# Altium project PCB_Project.PrjPcb
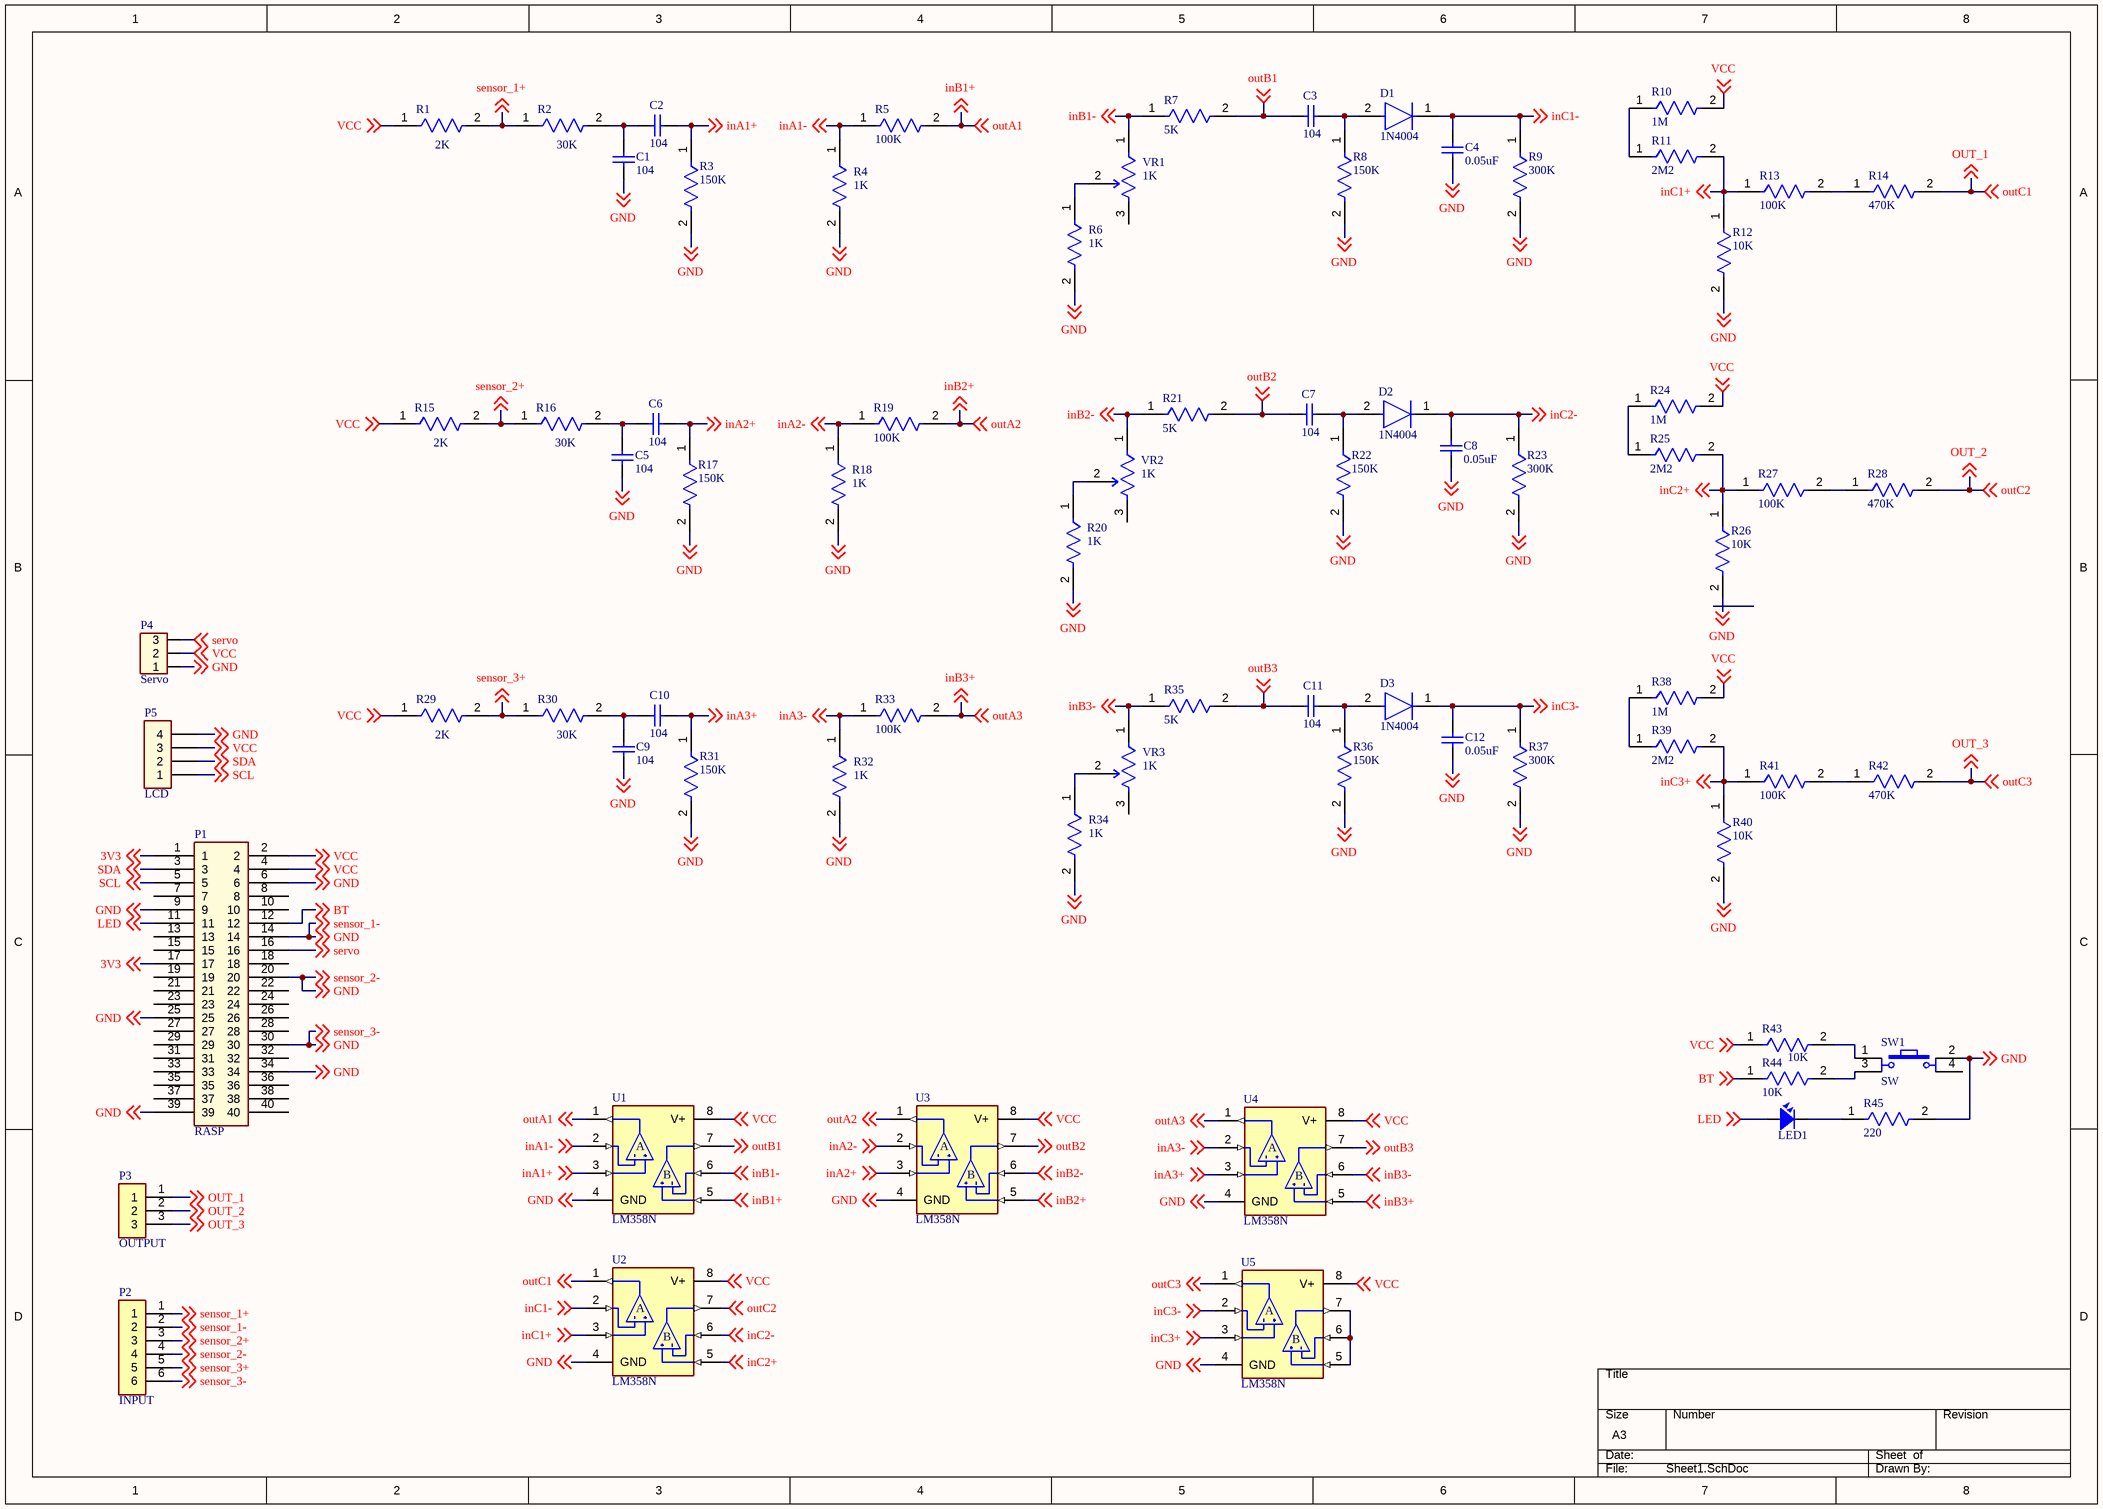
[diagram p0: Sheet1.SchDoc]
1 sheet, 75 parts. Net scope: global (net labels, ports and power ports of the same name join across sheets).
Board file: PCB1.PcbDoc

## Sheet Sheet1.SchDoc
size A3; SheetNumber: 1; SheetTotal: 1

### Parts
C1  104  [CAP_CERAMIC_MULTI]
C2  104  [CAP_CERAMIC_MULTI]
C3  104  [CAP_CERAMIC_MULTI]
C4  0.05uF  [CAP_CERAMIC_MULTI]
C5  104  [CAP_CERAMIC_MULTI]
C6  104  [CAP_CERAMIC_MULTI]
C7  104  [CAP_CERAMIC_MULTI]
C8  0.05uF  [CAP_CERAMIC_MULTI]
C9  104  [CAP_CERAMIC_MULTI]
C10  104  [CAP_CERAMIC_MULTI]
C11  104  [CAP_CERAMIC_MULTI]
C12  0.05uF  [CAP_CERAMIC_MULTI]
D1  1N4004  [DO-41]
D2  1N4004  [DO-41]
D3  1N4004  [DO-41]
LED1  LED  [LED-5-BLUE]  (value not drawn)
P1  RASP  [HED20X2]
P2  INPUT  [JP6]
P3  OUTPUT  [JP3]
P4  Servo  [CON3]
P5  LCD  [CON4]
R1  value 2K  [RES-1/8W-SMALL]  (hidden comment: RES-1/8W)
R2  value 30K  [RES-1/8W-SMALL]  (hidden comment: RES-1/8W)
R3  value 150K  [RES-1/8W-SMALL]  (hidden comment: RES-1/8W)
R4  value 1K  [RES-1/8W-SMALL]  (hidden comment: RES-1/8W)
R5  value 100K  [RES-1/8W-SMALL]  (hidden comment: RES-1/8W)
R6  value 1K  [RES-1/8W-SMALL]  (hidden comment: RES-1/8W)
R7  value 5K  [RES-1/8W-SMALL]  (hidden comment: RES-1/8W)
R8  value 150K  [RES-1/8W-SMALL]  (hidden comment: RES-1/8W)
R9  value 300K  [RES-1/8W-SMALL]  (hidden comment: RES-1/8W)
R10  value 1M  [RES-1/8W-SMALL]  (hidden comment: RES-1/8W)
R11  value 2M2  [RES-1/8W-SMALL]  (hidden comment: RES-1/8W)
R12  value 10K  [RES-1/8W-SMALL]  (hidden comment: RES-1/8W)
R13  value 100K  [RES-1/8W-SMALL]  (hidden comment: RES-1/8W)
R14  value 470K  [RES-1/8W-SMALL]  (hidden comment: RES-1/8W)
R15  value 2K  [RES-1/8W-SMALL]  (hidden comment: RES-1/8W)
R16  value 30K  [RES-1/8W-SMALL]  (hidden comment: RES-1/8W)
R17  value 150K  [RES-1/8W-SMALL]  (hidden comment: RES-1/8W)
R18  value 1K  [RES-1/8W-SMALL]  (hidden comment: RES-1/8W)
R19  value 100K  [RES-1/8W-SMALL]  (hidden comment: RES-1/8W)
R20  value 1K  [RES-1/8W-SMALL]  (hidden comment: RES-1/8W)
R21  value 5K  [RES-1/8W-SMALL]  (hidden comment: RES-1/8W)
R22  value 150K  [RES-1/8W-SMALL]  (hidden comment: RES-1/8W)
R23  value 300K  [RES-1/8W-SMALL]  (hidden comment: RES-1/8W)
R24  value 1M  [RES-1/8W-SMALL]  (hidden comment: RES-1/8W)
R25  value 2M2  [RES-1/8W-SMALL]  (hidden comment: RES-1/8W)
R26  value 10K  [RES-1/8W-SMALL]  (hidden comment: RES-1/8W)
R27  value 100K  [RES-1/8W-SMALL]  (hidden comment: RES-1/8W)
R28  value 470K  [RES-1/8W-SMALL]  (hidden comment: RES-1/8W)
R29  value 2K  [RES-1/8W-SMALL]  (hidden comment: RES-1/8W)
R30  value 30K  [RES-1/8W-SMALL]  (hidden comment: RES-1/8W)
R31  value 150K  [RES-1/8W-SMALL]  (hidden comment: RES-1/8W)
R32  value 1K  [RES-1/8W-SMALL]  (hidden comment: RES-1/8W)
R33  value 100K  [RES-1/8W-SMALL]  (hidden comment: RES-1/8W)
R34  value 1K  [RES-1/8W-SMALL]  (hidden comment: RES-1/8W)
R35  value 5K  [RES-1/8W-SMALL]  (hidden comment: RES-1/8W)
R36  value 150K  [RES-1/8W-SMALL]  (hidden comment: RES-1/8W)
R37  value 300K  [RES-1/8W-SMALL]  (hidden comment: RES-1/8W)
R38  value 1M  [RES-1/8W-SMALL]  (hidden comment: RES-1/8W)
R39  value 2M2  [RES-1/8W-SMALL]  (hidden comment: RES-1/8W)
R40  value 10K  [RES-1/8W-SMALL]  (hidden comment: RES-1/8W)
R41  value 100K  [RES-1/8W-SMALL]  (hidden comment: RES-1/8W)
R42  value 470K  [RES-1/8W-SMALL]  (hidden comment: RES-1/8W)
R43  value 10K  [RES-1/8W-SMALL]  (hidden comment: RES-1/8W)
R44  value 10K  [RES-1/8W-SMALL]  (hidden comment: RES-1/8W)
R45  value 220  [RES-1/8W-SMALL]  (hidden comment: RES-1/8W)
SW1  SW  [SW4]
U1  LM358N  [PDIP-8]
U2  LM358N  [PDIP-8]
U3  LM358N  [PDIP-8]
U4  LM358N  [PDIP-8]
U5  LM358N  [PDIP-8]
VR1  value 1K  [FP-3296W-MFG]  (hidden comment: 3296W-1-103LF)
VR2  value 1K  [FP-3296W-MFG]  (hidden comment: 3296W-1-103LF)
VR3  value 1K  [FP-3296W-MFG]  (hidden comment: 3296W-1-103LF)

### Nets
3V3: P1.1 P1.17 ; off-sheet 3V3
BT: P1.12 R44.1 ; off-sheet BT
GND: C1.1 C4.2 C5.1 C8.2 C9.1 C12.2 P1.6 P1.9 P1.14 P1.20 P1.25 P1.30 P1.34 P1.39 P2.2 P2.4 P2.6 P4.1 P5.4 R3.2 R4.2 R6.2 R8.2 R9.2 R12.2 R17.2 R18.2 R20.2 R22.2 R23.2 R26.2 R31.2 R32.2 R34.2 R36.2 R37.2 R40.2 R45.2 SW1.2 U1.4(GND) U2.4(GND) U3.4(GND) U4.4(GND) U5.4(GND) ; off-sheet GND, off-sheet sensor_1-, off-sheet sensor_2-, off-sheet sensor_3-  [also labelled sensor_1-, sensor_2-, sensor_3-]
inA1+: C2.1 R3.1 U1.3(+INA) ; off-sheet inA1+
inA1-: R4.1 R5.1 U1.2(-INA) ; off-sheet inA1-
inA2+: C6.1 R17.1 U3.3(+INA) ; off-sheet inA2+
inA2-: R18.1 R19.1 U3.2(-INA) ; off-sheet inA2-
inA3+: C10.1 R31.1 U4.3(+INA) ; off-sheet inA3+
inA3-: R32.1 R33.1 U4.2(-INA) ; off-sheet inA3-
inB1+: R5.2 U1.1(OUTA) U1.5(+INB) ; off-sheet outA1, off-sheet inB1+  [also labelled outA1]
inB1-: R7.1 U1.6(-INB) VR1.1(CCW) ; off-sheet inB1-
inB2+: R19.2 U3.1(OUTA) U3.5(+INB) ; off-sheet outA2, off-sheet inB2+  [also labelled outA2]
inB2-: R21.1 U3.6(-INB) VR2.1(CCW) ; off-sheet inB2-
inB3+: R33.2 U4.1(OUTA) U4.5(+INB) ; off-sheet outA3, off-sheet inB3+  [also labelled outA3]
inB3-: R35.1 U4.6(-INB) VR3.1(CCW) ; off-sheet inB3-
inC1+: R11.2 R12.1 R13.1 U2.3(+INA) ; off-sheet inC1+
inC1-: C4.1 D1.1(C) R9.1 U2.2(-INA) ; off-sheet inC1-
inC2+: R25.2 R26.1 R27.1 U2.5(+INB) ; off-sheet inC2+
inC2-: C8.1 D2.1(C) R23.1 U2.6(-INB) ; off-sheet inC2-
inC3+: R39.2 R40.1 R41.1 U5.3(+INA) ; off-sheet inC3+
inC3-: C12.1 D3.1(C) R37.1 U5.2(-INA) ; off-sheet inC3-
LED: LED1.1 P1.11 ; off-sheet LED
OUT_1: P3.1 R14.2 U2.1(OUTA) ; off-sheet outC1, off-sheet OUT_1  [also labelled outC1]
OUT_2: P3.2 R28.2 U2.7(OUTB) ; off-sheet outC2, off-sheet OUT_2  [also labelled outC2]
OUT_3: P3.3 R42.2 U5.1(OUTA) ; off-sheet outC3, off-sheet OUT_3  [also labelled outC3]
outB1: C3.2 R7.2 U1.7(OUTB) ; off-sheet outB1
outB2: C7.2 R21.2 U3.7(OUTB) ; off-sheet outB2
outB3: C11.2 R35.2 U4.7(OUTB) ; off-sheet outB3
SCL: P1.5 P5.1 ; off-sheet SCL
SDA: P1.3 P5.2 ; off-sheet SDA
sensor_1+: P2.1 R1.2 R2.1 ; off-sheet sensor_1+
sensor_2+: P2.3 R15.2 R16.1 ; off-sheet sensor_2+
sensor_3+: P2.5 R29.2 R30.1 ; off-sheet sensor_3+
servo: P1.16 P4.3 ; off-sheet servo
VCC: P1.2 P1.4 P4.2 P5.3 R1.1 R10.2 R15.1 R24.2 R29.1 R38.2 R43.1 U1.8(V+) U2.8(V+) U3.8(V+) U4.8(V+) U5.8(V+) ; off-sheet VCC
NetC1_2: C1.2 C2.2 R2.2
NetC3_1: C3.1 D1.2(A) R8.1
NetC5_2: C5.2 C6.2 R16.2
NetC7_1: C7.1 D2.2(A) R22.1
NetC9_2: C9.2 C10.2 R30.2
NetC11_1: C11.1 D3.2(A) R36.1
NetLED1_2: LED1.2 R45.1
NetR6_1: R6.1 VR1.2(WIPER)
NetR10_1: R10.1 R11.1
NetR13_2: R13.2 R14.1
NetR20_1: R20.1 VR2.2(WIPER)
NetR24_1: R24.1 R25.1
NetR27_2: R27.2 R28.1
NetR34_1: R34.1 VR3.2(WIPER)
NetR38_1: R38.1 R39.1
NetR41_2: R41.2 R42.1
NetR43_2: R43.2 SW1.1
NetR44_2: R44.2 SW1.3
NetU5_5: U5.5(+INB) U5.6(-INB) U5.7(OUTB)

Not connected (* = marked no-connect by the designer): P1 7 8 10 13 15 18 19 21 22 23 24 26 27 28 29 31 32 33 35 36 37 38 40; SW1 4; VR1 3(CW); VR2 3(CW); VR3 3(CW)

### Notes on the sheet
- DWG. NO.
- REV.
- SHT.
- THIS DOCUMENT AND THE DATA DISCLOSED HEREIN OR HEREWITH IS THE PROPERTY OF ALTIUM LIMITED AND MAY BE FREELY DISTRIBUTED IN WHOLE. NO RIGHTS ARE RESERVED OR EXPRESS OR IMPLIED WARANTEE GIVEN.
- REVISION
- DESCRIPTION
- DATE
- APPROVED
- ENG:
- APPROVALS
- PROJECT
- DSN:
- CHK:
- REFERENCE DOCUMENTS
- PROJECT REVISION:
- TITLE
- DOCUMENT REVISION:
- DESIGN ITEM:
- BOM:
- FAB DWG:
- PCB DWG:
- ASSY DWG:
- SCALE:
- SIZE
- B
- CAGE CODE
- FILE NAME
- DWG NO.
- SHEET
- OF
- REV
- (in symbol LM358N) A; B

### Library data of the parts
C1-C12 = CAP RADIAL: Radial Multilayer Ceramic Capacitor; Manufacturer: Kyocera AVX; Manufacturer Part Number: LD051C104KAB2A; Value: 100nF; Voltage Rating: 100V; Tolerance: 10%; Dielectric: X7R; Supplier: Arrow Electronics; Supplier Part Number: LD051C104KAB2A; RoHS: No; Category: Ceramic Capacitors; Stock: 6000; Pricing: 2000=0,35070 (USD); Mounting Technology: Surface Mount; Case/Package: 0805; Pins: 2; Case Code (Metric): 2012; Case Code (Imperial): 0805; Dielectric Material: Ceramic; Weight: 0.000194oz; Min Operating Temperature: -55°C; Max Operating Temperature: 125°C; Packaging: Tape and Reel; Voltage Rating (DC): 100V; Package Quantity: 1; Termination: SMD/SMT; Series: LD; Length: 0.079inch; Width: 0.049inch; Height: 1.4mm; Thickness: 0.037inch; Depth: 1.25mm; RoHS Compliant: No; Lead Free: Contains Lead; ComponentLink1URL: https://datasheet.ciiva.com/16443/tinterm-16443613.pdf?src-supplier=Future+Electronics; ComponentLink1Description: https://datasheet.ciiva.com/16443/tinterm-16443613.pdf?src-supplier=Future+Electronics; ComponentLink2URL: https://datasheet.ciiva.com/6256/tinterm-6256703.pdf?src-supplier=Digi-Key; ComponentLink2Description: https://datasheet.ciiva.com/6256/tinterm-6256703.pdf?src-supplier=Digi-Key
D1-D3 = 1N4004: Diode 1N4004 DO-41, 400V, 1.00A; Manufacturer: Diotec; Manufacturer Part Number: 1N4007; Max Surge Current: 27A; Peak Non-Repetitive Surge Current: 30A; Forward Voltage: 1V; Element Configuration: Single; Polarity: Standard; Supplier: Mouser; Supplier Part Number: 637-1N4007; RoHS: Yes; Category: Rectifier Diodes; Stock: 171929; Pricing: 1=0,40000, 10=0,13200, 50=0,13200, 100=0,09500, 500=0,06900, 1000=0,06600, 2500=0,06100, 5000=0,05200, 10000=0,04700 (USD); Mounting Technology: Through Hole; Pins: 2; Min Operating Temperature: -50°C; Max Operating Temperature: 175°C; Packaging: Ammo Pack; RoHS Compliant: Yes; ComponentLink1URL: https://datasheet.ciiva.com/26325/162272-da-01-ml-1n4007-silizium-diode-de-en-26325271.pdf?src-supplier=Conrad; ComponentLink1Description: https://datasheet.ciiva.com/26325/162272-da-01-ml-1n4007-silizium-diode-de-en-26325271.pdf?src-supplier=Conrad; ComponentLink2URL: https://datasheet.ciiva.com/48433/1n400x-eng-tds-48433165.pdf?src-supplier=Distrelec; ComponentLink2Description: https://datasheet.ciiva.com/48433/1n400x-eng-tds-48433165.pdf?src-supplier=Distrelec
LED1 = LED: LED Single colour Green and Red; Value: LED 3 ly Single Colour
P1 = HEADER 2X20P: Manufacturer: Harwin; Manufacturer Part Number: M20-9990246; Current Rating: 3A; Number of Contacts: 2; Gender: Male; Voltage Rating (AC): 750V; Connector Type: Male Pin; Contact Resistance: 30mR; Insulation Resistance: 10GR; Pitch: 2.54mm; Supplier: Rs; Supplier Part Number: 7457065; RoHS: Yes; Category: Headers and Wire Housings; Stock: 4090; Pricing: 10=0,07900, 100=0,07400 (GBP); Mounting Technology: Through Hole; Case/Package: SIL; Contact Plating: Tin; Color: Black; Contact Material: Bronze,Brass; Housing Material: Nylon; Housing Color: Black; Min Operating Temperature: -40°C; Max Operating Temperature: 105°C; Package Quantity: 1000; Packaging: Bulk; Termination: Solder; Series: M20; Number of Rows: 1; Number of Positions: 2; Orientation: Straight; Contact Type: Male Pin; Max Current Rating: 3A; Length: 5.08mm; Depth: 2.54mm; Contact Mating Length: 0.24inch; Radiation Hardening: No; RoHS Compliant: Yes; Reach SVHC Compliant: Yes; ComponentLink1URL: https://datasheet.ciiva.com/8046/315376-8046930.pdf?src-supplier=Element14; ComponentLink1Description: https://datasheet.ciiva.com/8046/315376-8046930.pdf?src-supplier=Element14; ComponentLink2URL: https://datasheet.ciiva.com/22660/1830818-22660571.pdf?src-supplier=Element14; ComponentLink2Description: https://datasheet.ciiva.com/22660/1830818-22660571.pdf?src-supplier=Element14; ComponentLink3URL: https://datasheet.ciiva.com/11745/0900766b81034e61-11745755.pdf?src-supplier=Rs; ComponentLink3Description: https://datasheet.ciiva.com/11745/0900766b81034e61-11745755.pdf?src-supplier=Rs; ComponentLink4URL: https://datasheet.ciiva.com/6833/m20-999-6833368.pdf?src-supplier=Digi-Key; ComponentLink4Description: https://datasheet.ciiva.com/6833/m20-999-6833368.pdf?src-supplier=Digi-Key; ComponentLink5URL: https://datasheet.ciiva.com/26852/getdatasheetpartid-384170-26852203.pdf?src-supplier=Verical; ComponentLink5Description: https://datasheet.ciiva.com/26852/getdatasheetpartid-384170-26852203.pdf?src-supplier=Verical
P2 = JP6: Male Header 2.54mm (0.1") Pitch SIL Vertical PC Tail Pin Header, 6.1mm mating pin height, tin, 2 contacts; Manufacturer: Harwin; Manufacturer Part Number: M20-9990246; Current Rating: 3A; Number of Contacts: 2; Voltage Rating (AC): 750V; Connector Type: Male Pin; Contact Resistance: 30mR; Insulation Resistance: 10GR; Supplier: Rs; Supplier Part Number: 7457065; RoHS: Yes; Category: Headers and Wire Housings; Stock: 4090; Pricing: 10=0,07900, 100=0,07400 (GBP); Mounting Technology: Through Hole; Case/Package: SIL; Contact Plating: Tin; Color: Black; Contact Material: Bronze,Brass; Housing Material: Nylon; Housing Color: Black; Min Operating Temperature: -40°C; Max Operating Temperature: 105°C; Package Quantity: 1000; Packaging: Bulk; Termination: Solder; Gender: Male; Series: M20; Number of Rows: 1; Number of Positions: 2; Orientation: Straight; Contact Type: Male Pin; Max Current Rating: 3A; Length: 5.08mm; Pitch: 2.54mm; Depth: 2.54mm; Contact Mating Length: 0.24inch; Radiation Hardening: No; RoHS Compliant: Yes; Reach SVHC Compliant: Yes; ComponentLink1URL: https://datasheet.ciiva.com/8046/315376-8046930.pdf?src-supplier=Element14; ComponentLink1Description: https://datasheet.ciiva.com/8046/315376-8046930.pdf?src-supplier=Element14; ComponentLink2URL: https://datasheet.ciiva.com/22660/1830818-22660571.pdf?src-supplier=Element14; ComponentLink2Description: https://datasheet.ciiva.com/22660/1830818-22660571.pdf?src-supplier=Element14; ComponentLink3URL: https://datasheet.ciiva.com/11745/0900766b81034e61-11745755.pdf?src-supplier=Rs; ComponentLink3Description: https://datasheet.ciiva.com/11745/0900766b81034e61-11745755.pdf?src-supplier=Rs; ComponentLink4URL: https://datasheet.ciiva.com/6833/m20-999-6833368.pdf?src-supplier=Digi-Key; ComponentLink4Description: https://datasheet.ciiva.com/6833/m20-999-6833368.pdf?src-supplier=Digi-Key; ComponentLink5URL: https://datasheet.ciiva.com/26852/getdatasheetpartid-384170-26852203.pdf?src-supplier=Verical; ComponentLink5Description: https://datasheet.ciiva.com/26852/getdatasheetpartid-384170-26852203.pdf?src-supplier=Verical
P3 = JP3: HEADER 3P; Manufacturer: Harwin; Manufacturer Part Number: M20-9990246; Current Rating: 3A; Number of Contacts: 2; Gender: Male; Voltage Rating (AC): 750V; Connector Type: Male Pin; Contact Resistance: 30mR; Insulation Resistance: 10GR; Pitch: 2.54mm; Supplier: Rs; Supplier Part Number: 7457065; RoHS: Yes; Category: Headers and Wire Housings; Stock: 4090; Pricing: 10=0,07900, 100=0,07400 (GBP); Mounting Technology: Through Hole; Case/Package: SIL; Contact Plating: Tin; Color: Black; Contact Material: Bronze,Brass; Housing Material: Nylon; Housing Color: Black; Min Operating Temperature: -40°C; Max Operating Temperature: 105°C; Package Quantity: 1000; Packaging: Bulk; Termination: Solder; Series: M20; Number of Rows: 1; Number of Positions: 2; Orientation: Straight; Contact Type: Male Pin; Max Current Rating: 3A; Length: 5.08mm; Depth: 2.54mm; Contact Mating Length: 0.24inch; Radiation Hardening: No; RoHS Compliant: Yes; Reach SVHC Compliant: Yes; ComponentLink1URL: https://datasheet.ciiva.com/8046/315376-8046930.pdf?src-supplier=Element14; ComponentLink1Description: https://datasheet.ciiva.com/8046/315376-8046930.pdf?src-supplier=Element14; ComponentLink2URL: https://datasheet.ciiva.com/22660/1830818-22660571.pdf?src-supplier=Element14; ComponentLink2Description: https://datasheet.ciiva.com/22660/1830818-22660571.pdf?src-supplier=Element14; ComponentLink3URL: https://datasheet.ciiva.com/11745/0900766b81034e61-11745755.pdf?src-supplier=Rs; ComponentLink3Description: https://datasheet.ciiva.com/11745/0900766b81034e61-11745755.pdf?src-supplier=Rs; ComponentLink4URL: https://datasheet.ciiva.com/6833/m20-999-6833368.pdf?src-supplier=Digi-Key; ComponentLink4Description: https://datasheet.ciiva.com/6833/m20-999-6833368.pdf?src-supplier=Digi-Key; ComponentLink5URL: https://datasheet.ciiva.com/26852/getdatasheetpartid-384170-26852203.pdf?src-supplier=Verical; ComponentLink5Description: https://datasheet.ciiva.com/26852/getdatasheetpartid-384170-26852203.pdf?src-supplier=Verical
P4 = Con3: Connector 3; Value: Connector 3
P5 = CON 4: Connector 4; Value: Connector 3
R1-R45 = RES-1/8W: RES 1/8W; Manufacturer: Bourns; Manufacturer Part Number: CR0805-JW-331ELF; Tolerance: 5%; Power Rating: 125mW; Voltage Rating: 150V; Temperature Coefficient: 200ppm/°C; Supplier: Arrow Electronics; Supplier Part Number: CR0805-JW-331ELF; RoHS: Yes; Category: Chip SMD Resistors; Stock: 10000; Pricing: 5000=0,00270, 10000=0,00240, 25000=0,00210, 50000=0,00210 (USD); Mounting Technology: Surface Mount; Case/Package: 0805; Pins: 2; Case Code (Metric): 2012; Case Code (Imperial): 0805; Contact Plating: Tin; Min Operating Temperature: -55°C; Max Operating Temperature: 155°C; Packaging: Tape and Reel; Package Quantity: 1; Resistor Type: Thick Film; Number of Terminations: 2; Termination: SMD/SMT; Max Power Dissipation: 125mW; Series: CR0805; Voltage Rating (DC): 150V; Features: Moisture Resistant; Resistance Tolerance: 5%; Construction: Rectangular; Length: 2mm; Width: 1.25mm; Height: 0.024inch; Depth: 1.25mm; Thickness: 508um; Radiation Hardening: No; RoHS Compliant: Yes; Reach SVHC Compliant: Yes; Military Standard: Not; ComponentLink1URL: https://datasheet.ciiva.com/22713/691949-22713270.pdf?src-supplier=Element14; ComponentLink1Description: https://datasheet.ciiva.com/22713/691949-22713270.pdf?src-supplier=Element14; ComponentLink2URL: https://datasheet.ciiva.com/9119/chpreztr-9119959.pdf?src-supplier=Avnet; ComponentLink2Description: https://datasheet.ciiva.com/9119/chpreztr-9119959.pdf?src-supplier=Avnet; ComponentLink3URL: https://datasheet.ciiva.com/46383/1791942-46383770.pdf?src-supplier=Element14; ComponentLink3Description: https://datasheet.ciiva.com/46383/1791942-46383770.pdf?src-supplier=Element14; ComponentLink4URL: https://datasheet.ciiva.com/6547/chpreztr-6547356.pdf?src-supplier=Digi-Key; ComponentLink4Description: https://datasheet.ciiva.com/6547/chpreztr-6547356.pdf?src-supplier=Digi-Key; ComponentLink5URL: https://datasheet.ciiva.com/6547/chpreztr-6547357.pdf?src-supplier=Digi-Key; ComponentLink5Description: https://datasheet.ciiva.com/6547/chpreztr-6547357.pdf?src-supplier=Digi-Key; ComponentLink6URL: https://datasheet.ciiva.com/6547/chpreztr-6547358.pdf?src-supplier=Digi-Key; ComponentLink6Description: https://datasheet.ciiva.com/6547/chpreztr-6547358.pdf?src-supplier=Digi-Key; ComponentLink7URL: https://datasheet.ciiva.com/7986/1902866-7986190.pdf?src-supplier=Element14; ComponentLink7Description: https://datasheet.ciiva.com/7986/1902866-7986190.pdf?src-supplier=Element14
SW1 = SW4: Switch button 4 pin; Value: Button chip 4 pin
U1-U5 = LM358N: MP: LM358PE3; Value: *; Package: None; Availability: Unavailable; Price: None
VR1-VR3 = 3296W-1-103LF: Trimmer 3296W, Cermet, Res 10 Kilohms. VR103; Manufacturer: Bourns; Power Rating: 500mW; Tolerance: 10%; Number of Turns: 25; Temperature Coefficient: 100ppm/°C; Insulation Resistance: 1GR; Supplier: Rs; Supplier Part Number: 5219647; Manufacturer Part Number: 3296W-1-103LF; RoHS: Yes; Category: Variable Resistors and Potentiometers; Stock: 3137; Pricing: 1=2,69000, 25=2,53000, 50=2,29000, 100=2,13000, 250=1,91000 (GBP); Mounting Technology: Through Hole,PCB; Weight: 0.03oz; Contact Plating: Tin,Matte; Color: Blue; Min Operating Temperature: -55°C; Max Operating Temperature: 125°C; Resistor Type: Cermet; Packaging: Rail/Tube; Package Quantity: 50; Termination: Pin; Taper: Linear; Max Power Dissipation: 500mW; Series: 3296; Resistance Tolerance: 10%; Technology: CERMET; Length: 9.53mm; Width: 9.53mm; Height: 11.55mm; Depth: 4.83mm; Radiation Hardening: No; Reach SVHC Compliant: Yes; Military Standard: Not; RoHS Compliant: Yes; Lead Free: Lead Free; ComponentLink1URL: https://datasheet.ciiva.com/11830/0900766b8069ccf4-11830871.pdf?src-supplier=Rs; ComponentLink1Description: https://datasheet.ciiva.com/11830/0900766b8069ccf4-11830871.pdf?src-supplier=Rs; ComponentLink2URL: https://datasheet.ciiva.com/19454/853572-19454866.pdf?src-supplier=Jameco; ComponentLink2Description: https://datasheet.ciiva.com/19454/853572-19454866.pdf?src-supplier=Jameco; ComponentLink3URL: https://datasheet.ciiva.com/29122/447277-da-01-en-trimmer-tht3296w-1-103lf-10k-0-5w-29122362.pdf?src-supplier=Conrad; ComponentLink3Description: https://datasheet.ciiva.com/29122/447277-da-01-en-trimmer-tht3296w-1-103lf-10k-0-5w-29122362.pdf?src-supplier=Conrad; ComponentLink4URL: https://datasheet.ciiva.com/14173/ew3296-dat-e-14173022.pdf?src-supplier=Distrelec; ComponentLink4Description: https://datasheet.ciiva.com/14173/ew3296-dat-e-14173022.pdf?src-supplier=Distrelec; ComponentLink5URL: https://datasheet.ciiva.com/3266/3296-3266187.pdf?src-supplier=Avnet; ComponentLink5Description: https://datasheet.ciiva.com/3266/3296-3266187.pdf?src-supplier=Avnet; ComponentLink6URL: https://datasheet.ciiva.com/2156/3296-2156893.pdf?src-supplier=Digi-Key; ComponentLink6Description: https://datasheet.ciiva.com/2156/3296-2156893.pdf?src-supplier=Digi-Key; ComponentLink7URL: https://datasheet.ciiva.com/30093/3296-30093899.pdf?src-supplier=Onlinecomponents.com; ComponentLink7Description: https://datasheet.ciiva.com/30093/3296-30093899.pdf?src-supplier=Onlinecomponents.com; ComponentLink8URL: https://datasheet.ciiva.com/18411/70153578-18411561.pdf?src-supplier=Allied+Electronics; ComponentLink8Description: https://datasheet.ciiva.com/18411/70153578-18411561.pdf?src-supplier=Allied+Electronics; ComponentLink9URL: https://datasheet.ciiva.com/1131/1815117-1131273.pdf?src-supplier=Element14; ComponentLink9Description: https://datasheet.ciiva.com/1131/1815117-1131273.pdf?src-supplier=Element14